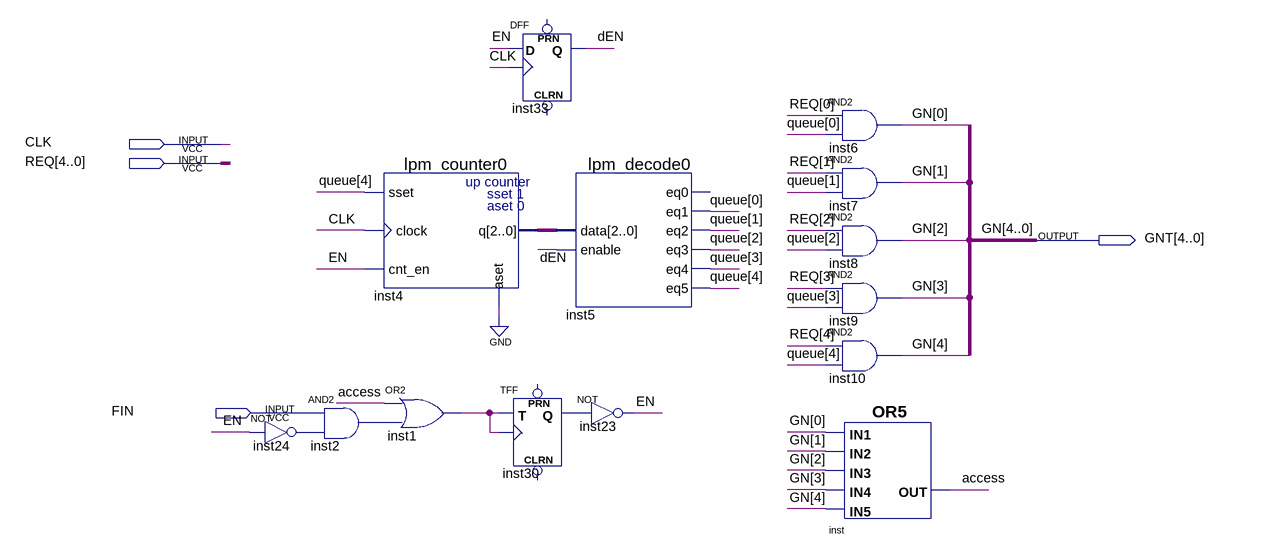
[diagram p0: schematic sheet]
// Quartus schematic Arbiter.bdf as structural Verilog: 14 symbols, 4 pins
module Arbiter (
  input  CLK,
  input  [4:0] REQ,
  input  FIN,
  output [4:0] GNT
);

  wire access, dEN, EN, inst1_out, inst2_out, inst24_out, inst30_q;
  wire [2:0] inst4_q;
  wire [4:0] queue;

  not inst24 (inst24_out, EN);
  and inst2 (inst2_out, FIN, inst24_out);
  lpm_counter0 inst4 (.sset(queue[4]), .clock(CLK), .cnt_en(EN), .aset(1'b0), .q(inst4_q));
  or inst1 (inst1_out, access, inst2_out);
  DFF inst33 (.CLK(CLK), .D(EN), .Q(dEN));  // open: CLRN, PRN
  TFF inst30 (.T(inst1_out), .CLK(inst1_out), .Q(inst30_q));  // open: PRN, CLRN
  lpm_decode0 inst5 (
    .data(inst4_q), .enable(dEN), .eq1(queue[0]), .eq2(queue[1]), .eq3(queue[2]), .eq4(queue[3]),
    .eq5(queue[4]));  // open: eq0
  not inst23 (EN, inst30_q);
  and inst6 (GNT[0], REQ[0], queue[0]);
  and inst7 (GNT[1], REQ[1], queue[1]);
  and inst8 (GNT[2], REQ[2], queue[2]);
  and inst9 (GNT[3], REQ[3], queue[3]);
  and inst10 (GNT[4], REQ[4], queue[4]);
  or inst (access, GNT[0], GNT[1], GNT[2], GNT[3], GNT[4]);

  // Other names for the same wires on the sheet: GN[4:0] = GNT
endmodule
